# Altium schematic sheet wing.SchDoc: Posedge LogiX1 MegaWing
size A; Organization: www.posedge.ir; Address1: TORANJ Inc.; Address2: Isfahan Science and; Address3: Technology Town, Isfahan; Address4: IRAN; Revision: 1.2; ProjectName: Posegde One
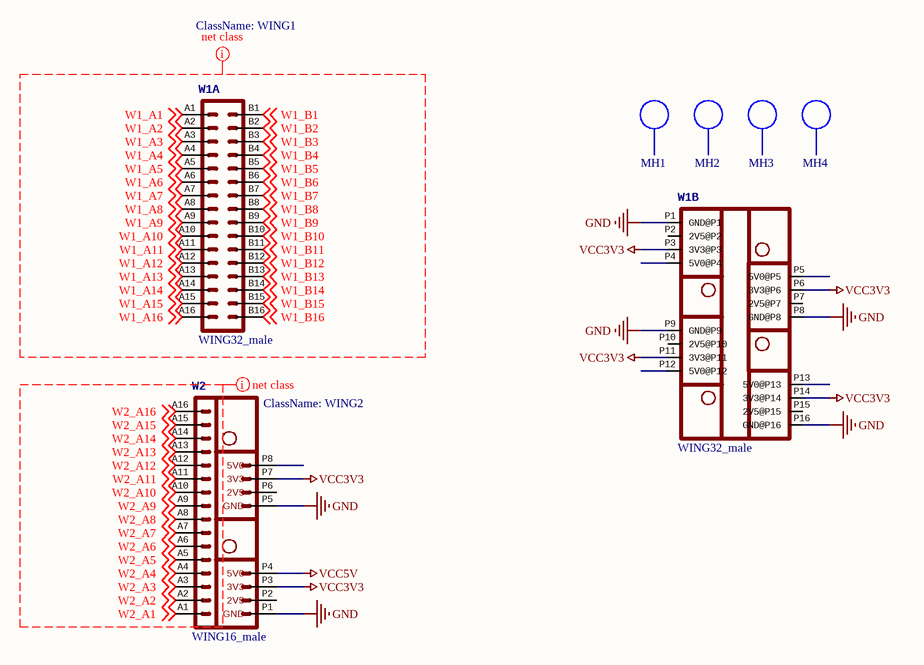
[diagram p0: wing.SchDoc]

## Parts
MH1  MOUNTING HOLE  [MOUNTING_HOLE]  (value not drawn)  (no BOM)
MH2  MOUNTING HOLE  [MOUNTING_HOLE]  (value not drawn)  (no BOM)
MH3  MOUNTING HOLE  [MOUNTING_HOLE]  (value not drawn)  (no BOM)
MH4  MOUNTING HOLE  [MOUNTING_HOLE]  (value not drawn)  (no BOM)
W1  WING32_male  [WING32_HOLES - MALE]  (parts A,B of 2)
W2  WING16_male  [WINGSIDE_16BIT - male]

## Nets
GND: W1.P1(GND@P1) W1.P8(GND@P8) W1.P9(GND@P9) W1.P16(GND@P16) W2.P1(GND) W2.P5(GND)
VCC3V3: W1.P3(3V3@P3) W1.P6(3V3@P6) W1.P11(3V3@P11) W1.P14(3V3@P14) W2.P3(3V3) W2.P7(3V3)
VCC5V: W2.P4(5V)
W1_A1: W1.A1 ; off-sheet W1_A1
W1_A2: W1.A2 ; off-sheet W1_A2
W1_A3: W1.A3 ; off-sheet W1_A3
W1_A4: W1.A4 ; off-sheet W1_A4
W1_A5: W1.A5 ; off-sheet W1_A5
W1_A6: W1.A6 ; off-sheet W1_A6
W1_A7: W1.A7 ; off-sheet W1_A7
W1_A8: W1.A8 ; off-sheet W1_A8
W1_A9: W1.A9 ; off-sheet W1_A9
W1_A10: W1.A10 ; off-sheet W1_A10
W1_A11: W1.A11 ; off-sheet W1_A11
W1_A12: W1.A12 ; off-sheet W1_A12
W1_A13: W1.A13 ; off-sheet W1_A13
W1_A14: W1.A14 ; off-sheet W1_A14
W1_A15: W1.A15 ; off-sheet W1_A15
W1_A16: W1.A16 ; off-sheet W1_A16
W1_B1: W1.B1 ; off-sheet W1_B1
W1_B2: W1.B2 ; off-sheet W1_B2
W1_B3: W1.B3 ; off-sheet W1_B3
W1_B4: W1.B4 ; off-sheet W1_B4
W1_B5: W1.B5 ; off-sheet W1_B5
W1_B6: W1.B6 ; off-sheet W1_B6
W1_B7: W1.B7 ; off-sheet W1_B7
W1_B8: W1.B8 ; off-sheet W1_B8
W1_B9: W1.B9 ; off-sheet W1_B9
W1_B10: W1.B10 ; off-sheet W1_B10
W1_B11: W1.B11 ; off-sheet W1_B11
W1_B12: W1.B12 ; off-sheet W1_B12
W1_B13: W1.B13 ; off-sheet W1_B13
W1_B14: W1.B14 ; off-sheet W1_B14
W1_B15: W1.B15 ; off-sheet W1_B15
W1_B16: W1.B16 ; off-sheet W1_B16
W2_A1: W2.A1 ; off-sheet W2_A1
W2_A2: W2.A2 ; off-sheet W2_A2
W2_A3: W2.A3 ; off-sheet W2_A3
W2_A4: W2.A4 ; off-sheet W2_A4
W2_A5: W2.A5 ; off-sheet W2_A5
W2_A6: W2.A6 ; off-sheet W2_A6
W2_A7: W2.A7 ; off-sheet W2_A7
W2_A8: W2.A8 ; off-sheet W2_A8
W2_A9: W2.A9 ; off-sheet W2_A9
W2_A10: W2.A10 ; off-sheet W2_A10
W2_A11: W2.A11 ; off-sheet W2_A11
W2_A12: W2.A12 ; off-sheet W2_A12
W2_A13: W2.A13 ; off-sheet W2_A13
W2_A14: W2.A14 ; off-sheet W2_A14
W2_A15: W2.A15 ; off-sheet W2_A15
W2_A16: W2.A16 ; off-sheet W2_A16

Not connected (* = marked no-connect by the designer): MH1 1; MH2 1; MH3 1; MH4 1; W1 P2(2V5@P2) P4(5V0@P4) P5(5V0@P5) P7(2V5@P7) P10(2V5@P10) P12(5V0@P12) P13(5V0@P13) P15(2V5@P15); W2 P2(2V2) P6(2V5) P8(5V)

## Layout directives
net class WING1: W1_A1, W1_A2, W1_A3, W1_A4, W1_A5, W1_A6, W1_A7, W1_A8, W1_A9, W1_A10, W1_A11, W1_A12, W1_A13, W1_A14, W1_A15, W1_A16, W1_B1, W1_B2, W1_B3, W1_B4, W1_B5, W1_B6, W1_B7, W1_B8, W1_B9, W1_B10, W1_B11, W1_B12, W1_B13, W1_B14, W1_B15, W1_B16
net class WING2: W2_A1, W2_A2, W2_A3, W2_A4, W2_A5, W2_A6, W2_A7, W2_A8, W2_A9, W2_A10, W2_A11, W2_A12, W2_A13, W2_A14, W2_A15, W2_A16

## Notes on the sheet
- Title
- Size:
- Date:
- A
- Number:
- Revision:
- Sheet
- of
- (in symbol WING16_male) 5V0

## Library data of the parts
MH1-MH4 = MOUNTING_HOLE
W2 = WING16_male: Papilio Wing16